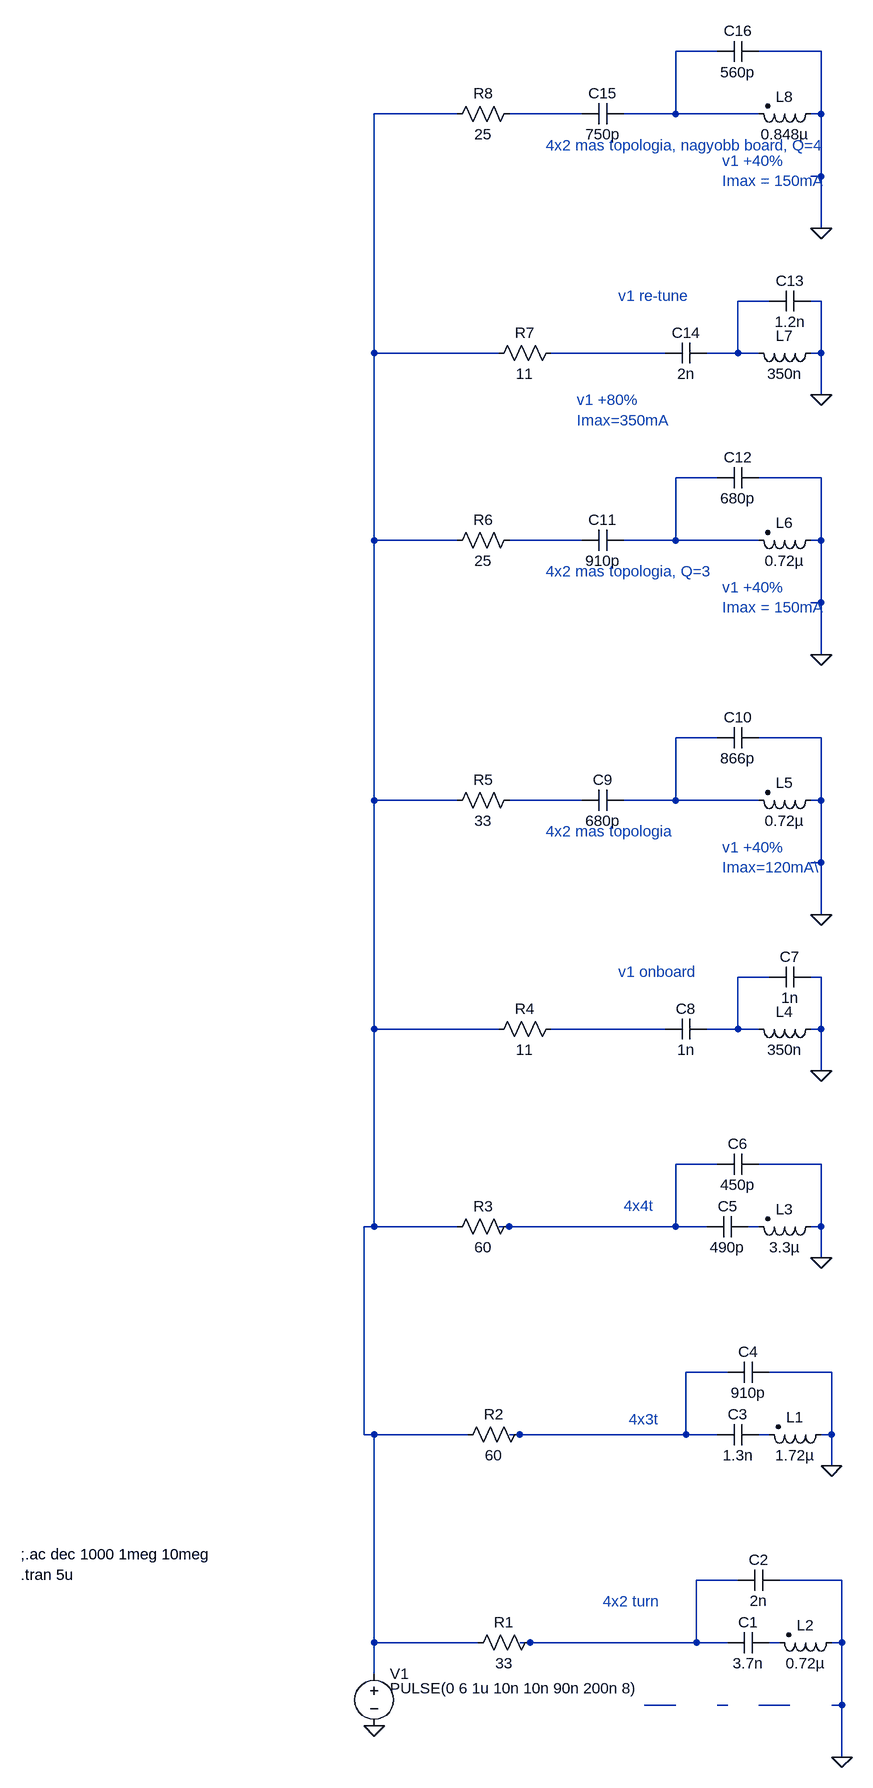
[diagram p0: schematic antenna-tuning.asc]
antenna-tuning.asc, the LTspice schematic file:
Version 4
SHEET 1 880 680
WIRE 480 -2224 416 -2224
WIRE 640 -2224 544 -2224
WIRE 80 -2128 -48 -2128
WIRE 272 -2128 160 -2128
WIRE 416 -2128 416 -2224
WIRE 416 -2128 336 -2128
WIRE 544 -2128 416 -2128
WIRE 640 -2128 640 -2224
WIRE 640 -2128 624 -2128
WIRE 640 -2032 640 -2128
WIRE 640 -2032 624 -2032
WIRE 640 -1952 640 -2032
WIRE 560 -1840 512 -1840
WIRE 640 -1840 624 -1840
WIRE -48 -1760 -48 -2128
WIRE 144 -1760 -48 -1760
WIRE 400 -1760 224 -1760
WIRE 512 -1760 512 -1840
WIRE 512 -1760 464 -1760
WIRE 544 -1760 512 -1760
WIRE 640 -1760 640 -1840
WIRE 640 -1760 624 -1760
WIRE 640 -1696 640 -1760
WIRE 480 -1568 416 -1568
WIRE 640 -1568 544 -1568
WIRE -48 -1472 -48 -1760
WIRE 80 -1472 -48 -1472
WIRE 272 -1472 160 -1472
WIRE 416 -1472 416 -1568
WIRE 416 -1472 336 -1472
WIRE 544 -1472 416 -1472
WIRE 640 -1472 640 -1568
WIRE 640 -1472 624 -1472
WIRE 640 -1376 640 -1472
WIRE 640 -1376 624 -1376
WIRE 640 -1296 640 -1376
WIRE 480 -1168 416 -1168
WIRE 640 -1168 544 -1168
WIRE -48 -1072 -48 -1472
WIRE 80 -1072 -48 -1072
WIRE 272 -1072 160 -1072
WIRE 416 -1072 416 -1168
WIRE 416 -1072 336 -1072
WIRE 544 -1072 416 -1072
WIRE 640 -1072 640 -1168
WIRE 640 -1072 624 -1072
WIRE 640 -976 640 -1072
WIRE 640 -976 624 -976
WIRE 640 -896 640 -976
WIRE 560 -800 512 -800
WIRE 640 -800 624 -800
WIRE -48 -720 -48 -1072
WIRE 144 -720 -48 -720
WIRE 400 -720 224 -720
WIRE 512 -720 512 -800
WIRE 512 -720 464 -720
WIRE 544 -720 512 -720
WIRE 640 -720 640 -800
WIRE 640 -720 624 -720
WIRE 640 -656 640 -720
WIRE 480 -512 416 -512
WIRE 640 -512 544 -512
WIRE -48 -416 -48 -720
WIRE -48 -416 -64 -416
WIRE 80 -416 -48 -416
WIRE 160 -416 144 -416
WIRE 416 -416 416 -512
WIRE 416 -416 160 -416
WIRE 464 -416 416 -416
WIRE 544 -416 528 -416
WIRE 640 -416 640 -512
WIRE 640 -416 624 -416
WIRE 640 -368 640 -416
WIRE 496 -192 432 -192
WIRE 656 -192 560 -192
WIRE -64 -96 -64 -416
WIRE -48 -96 -64 -96
WIRE 96 -96 -48 -96
WIRE 176 -96 160 -96
WIRE 432 -96 432 -192
WIRE 432 -96 176 -96
WIRE 480 -96 432 -96
WIRE 560 -96 544 -96
WIRE 656 -96 656 -192
WIRE 656 -96 640 -96
WIRE 656 -48 656 -96
WIRE 512 128 448 128
WIRE 672 128 576 128
WIRE -48 224 -48 -96
WIRE 112 224 -48 224
WIRE 192 224 176 224
WIRE 448 224 448 128
WIRE 448 224 192 224
WIRE 496 224 448 224
WIRE 576 224 560 224
WIRE 672 224 672 128
WIRE 672 224 656 224
WIRE -48 272 -48 224
WIRE 416 320 368 320
WIRE 496 320 480 320
WIRE 592 320 544 320
WIRE 672 320 672 224
WIRE 672 320 656 320
WIRE 672 400 672 320
FLAG -48 352 0
FLAG 672 400 0
FLAG 656 -48 0
FLAG 640 -368 0
FLAG 640 -656 0
FLAG 640 -896 0
FLAG 640 -1296 0
FLAG 640 -1696 0
FLAG 640 -1952 0
SYMBOL voltage -48 256 R0
WINDOW 3 24 38 Left 2
SYMATTR InstName V1
SYMATTR Value PULSE(0 6 1u 10n 10n 90n 200n 8)
SYMATTR Value2 AC 1
SYMBOL res 208 208 R90
WINDOW 0 0 56 VBottom 2
WINDOW 3 32 56 VTop 2
SYMATTR InstName R1
SYMATTR Value 33
SYMBOL ind2 672 208 R90
WINDOW 0 5 56 VBottom 2
WINDOW 3 32 56 VTop 2
SYMATTR InstName L2
SYMATTR Value 0.72µ
SYMATTR Type ind
SYMBOL cap 560 208 R90
WINDOW 0 0 32 VBottom 2
WINDOW 3 32 32 VTop 2
SYMATTR InstName C1
SYMATTR Value 3.7n
SYMBOL cap 576 112 R90
WINDOW 0 0 32 VBottom 2
WINDOW 3 32 32 VTop 2
SYMATTR InstName C2
SYMATTR Value 2n
SYMBOL res 192 -112 R90
WINDOW 0 0 56 VBottom 2
WINDOW 3 32 56 VTop 2
SYMATTR InstName R2
SYMATTR Value 60
SYMBOL ind2 656 -112 R90
WINDOW 0 5 56 VBottom 2
WINDOW 3 32 56 VTop 2
SYMATTR InstName L1
SYMATTR Value 1.72µ
SYMATTR Type ind
SYMBOL cap 544 -112 R90
WINDOW 0 0 32 VBottom 2
WINDOW 3 32 32 VTop 2
SYMATTR InstName C3
SYMATTR Value 1.3n
SYMBOL cap 560 -208 R90
WINDOW 0 0 32 VBottom 2
WINDOW 3 32 32 VTop 2
SYMATTR InstName C4
SYMATTR Value 910p
SYMBOL res 176 -432 R90
WINDOW 0 0 56 VBottom 2
WINDOW 3 32 56 VTop 2
SYMATTR InstName R3
SYMATTR Value 60
SYMBOL ind2 640 -432 R90
WINDOW 0 5 56 VBottom 2
WINDOW 3 32 56 VTop 2
SYMATTR InstName L3
SYMATTR Value 3.3µ
SYMATTR Type ind
SYMBOL cap 528 -432 R90
WINDOW 0 0 32 VBottom 2
WINDOW 3 32 32 VTop 2
SYMATTR InstName C5
SYMATTR Value 490p
SYMBOL cap 544 -528 R90
WINDOW 0 0 32 VBottom 2
WINDOW 3 32 32 VTop 2
SYMATTR InstName C6
SYMATTR Value 450p
SYMBOL ind 640 -736 R90
WINDOW 0 5 56 VBottom 2
WINDOW 3 32 56 VTop 2
SYMATTR InstName L4
SYMATTR Value 350n
SYMBOL cap 624 -816 R90
WINDOW 0 0 32 VBottom 2
WINDOW 3 32 32 VTop 2
SYMATTR InstName C7
SYMATTR Value 1n
SYMBOL cap 464 -736 R90
WINDOW 0 0 32 VBottom 2
WINDOW 3 32 32 VTop 2
SYMATTR InstName C8
SYMATTR Value 1n
SYMBOL res 240 -736 R90
WINDOW 0 0 56 VBottom 2
WINDOW 3 32 56 VTop 2
SYMATTR InstName R4
SYMATTR Value 11
SYMBOL res 176 -1088 R90
WINDOW 0 0 56 VBottom 2
WINDOW 3 32 56 VTop 2
SYMATTR InstName R5
SYMATTR Value 33
SYMBOL ind2 640 -1088 R90
WINDOW 0 5 56 VBottom 2
WINDOW 3 32 56 VTop 2
SYMATTR InstName L5
SYMATTR Value 0.72µ
SYMATTR Type ind
SYMBOL cap 336 -1088 R90
WINDOW 0 0 32 VBottom 2
WINDOW 3 32 32 VTop 2
SYMATTR InstName C9
SYMATTR Value 680p
SYMBOL cap 544 -1184 R90
WINDOW 0 0 32 VBottom 2
WINDOW 3 32 32 VTop 2
SYMATTR InstName C10
SYMATTR Value 866p
SYMBOL res 176 -1488 R90
WINDOW 0 0 56 VBottom 2
WINDOW 3 32 56 VTop 2
SYMATTR InstName R6
SYMATTR Value 25
SYMBOL ind2 640 -1488 R90
WINDOW 0 5 56 VBottom 2
WINDOW 3 32 56 VTop 2
SYMATTR InstName L6
SYMATTR Value 0.72µ
SYMATTR Type ind
SYMBOL cap 336 -1488 R90
WINDOW 0 0 32 VBottom 2
WINDOW 3 32 32 VTop 2
SYMATTR InstName C11
SYMATTR Value 910p
SYMBOL cap 544 -1584 R90
WINDOW 0 0 32 VBottom 2
WINDOW 3 32 32 VTop 2
SYMATTR InstName C12
SYMATTR Value 680p
SYMBOL ind 640 -1776 R90
WINDOW 0 5 56 VBottom 2
WINDOW 3 32 56 VTop 2
SYMATTR InstName L7
SYMATTR Value 350n
SYMBOL cap 624 -1856 R90
WINDOW 0 0 32 VBottom 2
WINDOW 3 32 32 VTop 2
SYMATTR InstName C13
SYMATTR Value 1.2n
SYMBOL cap 464 -1776 R90
WINDOW 0 0 32 VBottom 2
WINDOW 3 32 32 VTop 2
SYMATTR InstName C14
SYMATTR Value 2n
SYMBOL res 240 -1776 R90
WINDOW 0 0 56 VBottom 2
WINDOW 3 32 56 VTop 2
SYMATTR InstName R7
SYMATTR Value 11
SYMBOL res 176 -2144 R90
WINDOW 0 0 56 VBottom 2
WINDOW 3 32 56 VTop 2
SYMATTR InstName R8
SYMATTR Value 25
SYMBOL ind2 640 -2144 R90
WINDOW 0 5 56 VBottom 2
WINDOW 3 32 56 VTop 2
SYMATTR InstName L8
SYMATTR Value 0.848µ
SYMATTR Type ind
SYMBOL cap 336 -2144 R90
WINDOW 0 0 32 VBottom 2
WINDOW 3 32 32 VTop 2
SYMATTR InstName C15
SYMATTR Value 750p
SYMBOL cap 544 -2240 R90
WINDOW 0 0 32 VBottom 2
WINDOW 3 32 32 VTop 2
SYMATTR InstName C16
SYMATTR Value 560p
TEXT -592 88 Left 2 !;.ac dec 1000 1meg 10meg\n.tran 5u
TEXT 304 160 Left 2 ;4x2 turn
TEXT 344 -120 Left 2 ;4x3t
TEXT 336 -448 Left 2 ;4x4t
TEXT 328 -808 Left 2 ;v1 onboard
TEXT 216 -1024 Left 2 ;4x2 mas topologia
TEXT 488 -1000 Left 2 ;v1 +40%\nImax=120mA\\
TEXT 216 -1424 Left 2 ;4x2 mas topologia, Q=3
TEXT 488 -1400 Left 2 ;v1 +40%\nImax = 150mA
TEXT 328 -1848 Left 2 ;v1 re-tune
TEXT 264 -1688 Left 2 ;v1 +80%\nImax=350mA
TEXT 216 -2080 Left 2 ;4x2 mas topologia, nagyobb board, Q=4
TEXT 488 -2056 Left 2 ;v1 +40%\nImax = 150mA

The netlist it stands for:
* antenna-tuning.asc
V1 N002 0 PULSE(0 6 1u 10n 10n 90n 200n 8) AC 1
R1 N016 N002 33
L2 0 N017 0.72µ
C1 N017 N016 3.7n
C2 0 N016 2n
R2 N014 N002 60
L1 0 N015 1.72µ
C3 N015 N014 1.3n
C4 0 N014 910p
R3 N012 N002 60
L3 0 N013 3.3µ
C5 N013 N012 490p
C6 0 N012 450p
L4 0 N010 350n
C7 0 N010 1n
C8 N010 N011 1n
R4 N011 N002 11
R5 N009 N002 33
L5 0 N008 0.72µ
C9 N008 N009 680p
C10 0 N008 866p
R6 N007 N002 25
L6 0 N006 0.72µ
C11 N006 N007 910p
C12 0 N006 680p
L7 0 N004 350n
C13 0 N004 1.2n
C14 N004 N005 2n
R7 N005 N002 11
R8 N003 N002 25
L8 0 N001 0.848µ
C15 N001 N003 750p
C16 0 N001 560p
;.ac dec 1000 1meg 10meg
.tran 5u
* 4x2 turn
* 4x3t
* 4x4t
* v1 onboard
* 4x2 mas topologia
* v1 +40%
* Imax=120mA\
* 4x2 mas topologia, Q=3
* v1 +40%
* Imax = 150mA
* v1 re-tune
* v1 +80%
* Imax=350mA
* 4x2 mas topologia, nagyobb board, Q=4
* v1 +40%
* Imax = 150mA
.backanno
.end